# Altium schematic sheet 02-multimodal-pmic.SchDoc
size A4; SheetNumber: 3; SheetTotal: 13
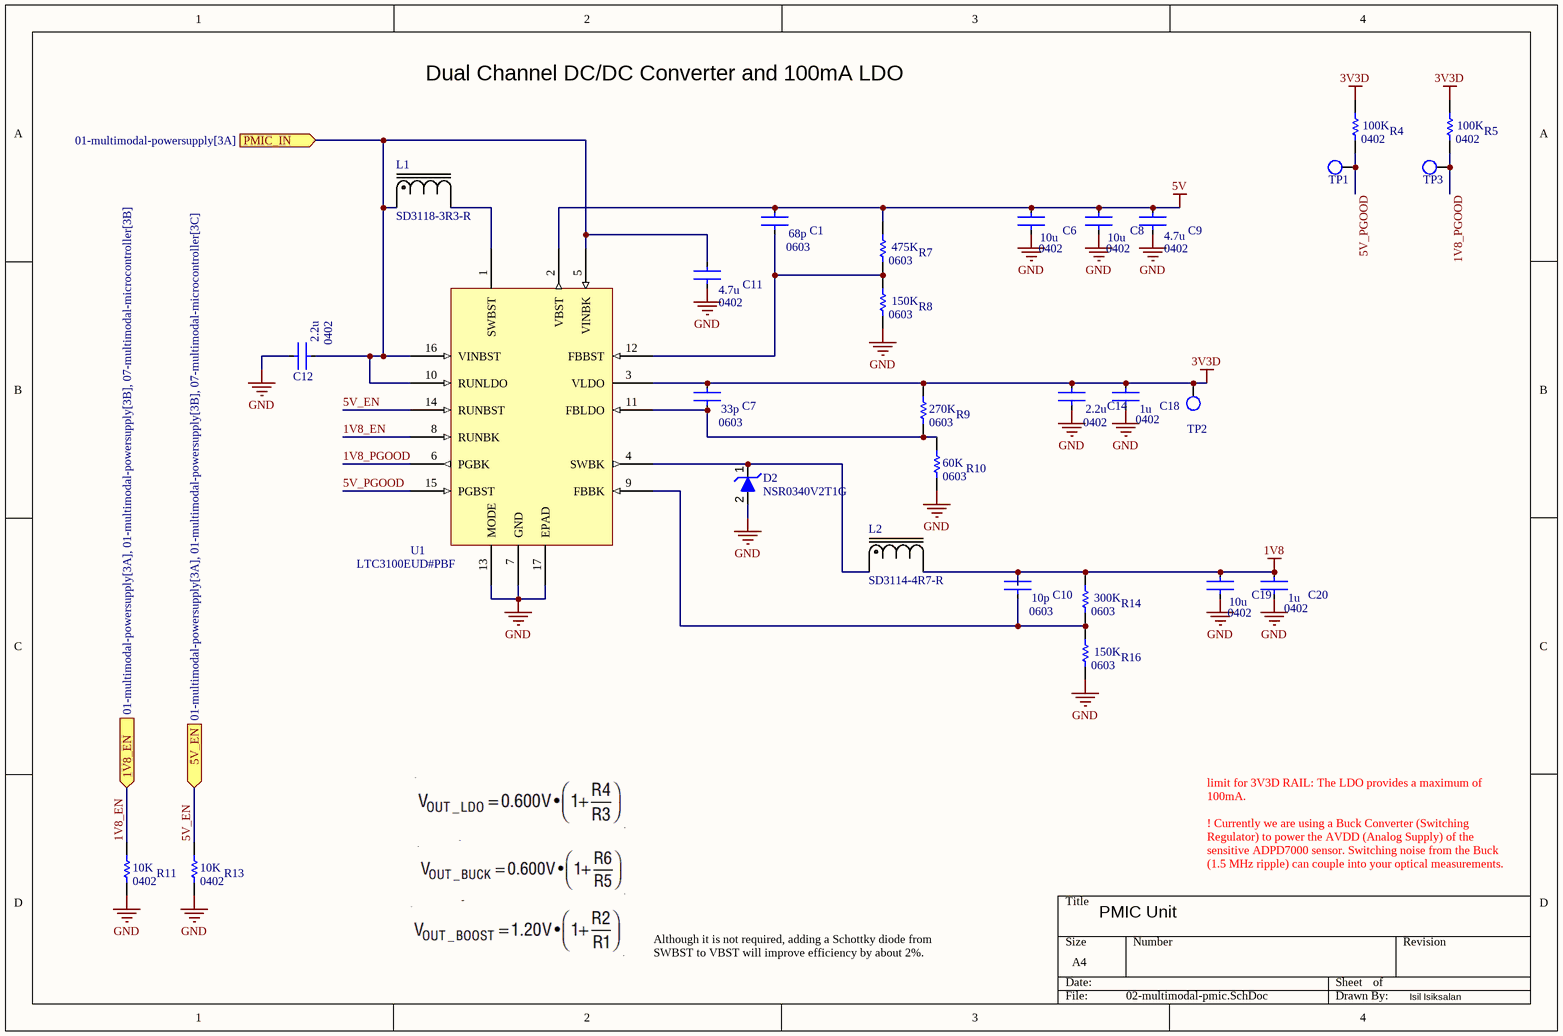
[diagram p0: 02-multimodal-pmic.SchDoc]

## Parts
C1  CGA3E2C0G1H680J080AA  [CAPTDK0603]  (value not drawn)
C6  GRM155R61A106ME11D  [CAPTDK0402]  (value not drawn)
C7  CGA3E2C0G1H330J080AA  [CAPTDK0603]  (value not drawn)
C8  GRM155R61A106ME11D  [CAPTDK0402]  (value not drawn)
C9  C1005X5R1A475K050BC  [CAPTDK0402]  (value not drawn)
C10  CGA3E2C0G1H100D080AA  [CAPTDK0603]  (value not drawn)
C11  C1005X5R1A475K050BC  [CAPTDK0402]  (value not drawn)
C12  CL05A225KO5NQNC  [CAPTDK0402]  (value not drawn)
C14  CL05A225KO5NQNC  [CAPTDK0402]  (value not drawn)
C18  C1005X5R1V105K050BC  [CAPTDK0402]  (value not drawn)
C19  GRM155R61A106ME11D  [CAPTDK0402]  (value not drawn)
C20  C1005X5R1V105K050BC  [CAPTDK0402]  (value not drawn)
D2  NSR0340V2T1G  [SOD-523_STM-L]
L1  SD3118-3R3-R  [SD3118]
L2  SD3114-4R7-R  [SD3114]
R4  RMCF0402FT100K  [RES-STACK-POLE-0402]  (value not drawn)
R5  RMCF0402FT100K  [RES-STACK-POLE-0402]  (value not drawn)
R7  RMCF0603FT475K  [RES-STACK-POLE-0603]  (value not drawn)
R8  RC0603FR-07150KL  [RES-STACK-POLE-0603]  (value not drawn)
R9  RC0603FR-07270KL  [RES-STACK-POLE-0603]  (value not drawn)
R10  RT0603BRD0760KL  [RES-STACK-POLE-0603]  (value not drawn)
R11  RMCF0402FT10K0  [RES-STACK-POLE-0402]  (value not drawn)
R13  RMCF0402FT10K0  [RES-STACK-POLE-0402]  (value not drawn)
R14  RMCF0603FT300K  [RES-STACK-POLE-0603]  (value not drawn)
R16  RC0603FR-07150KL  [RES-STACK-POLE-0603]  (value not drawn)
TP1  TESTPOINT_S  [TESTPOINT_S]  (value not drawn)  (no BOM)
TP2  TESTPOINT_S  [TESTPOINT_S]  (value not drawn)  (no BOM)
TP3  TESTPOINT_S  [TESTPOINT_S]  (value not drawn)  (no BOM)
U1  LTC3100EUD#PBF  [LTC3100EUD#PBF]

## Ports
1V8_EN (in, see 01-multimodal-powersupply[3A], 01-multimodal-powersupply[3B], 07-multimodal-microcontroller[3B]), 5V_EN (in, see 01-multimodal-powersupply[3A], 01-multimodal-powersupply[3B], 07-multimodal-microcontroller[3C]), PMIC_IN (in, see 01-multimodal-powersupply[3A])

## Nets
1V8: C10.1 C19.1 C20.1 L2.2 R14.2
3V3D: C7.1 C14.1 C18.1 R4.2 R5.2 R9.2 TP2.1 U1.3(VLDO)
5V: C1.1 C6.1 C8.1 C9.1 R7.2 U1.2(VBST)
GND: C6.2 C8.2 C9.2 C11.2 C12.1 C14.2 C18.2 C19.2 C20.2 D2.2 R8.1 R10.1 R11.1 R13.1 R16.1 U1.7(GND) U1.13(MODE) U1.17(EPAD)
1V8_EN: R11.2 U1.8(RUNBK) ; port 1V8_EN
1V8_PGOOD: R5.1 TP3.1 U1.6(PGBK)
5V_EN: R13.2 U1.14(RUNBST) ; port 5V_EN
5V_PGOOD: R4.1 TP1.1 U1.15(PGBST)
PMIC_IN: C11.1 C12.2 L1.1 U1.5(VINBK) U1.10(RUNLDO) U1.16(VINBST) ; port PMIC_IN
NetC1_2: C1.2 R7.1 R8.2 U1.12(FBBST)
NetC7_2: C7.2 R9.1 R10.2 U1.11(FBLDO)
NetC10_2: C10.2 R14.1 R16.2 U1.9(FBBK)
NetD2_1: D2.1 L2.1 U1.4(SWBK)
NetL1_2: L1.2 U1.1(SWBST)

## Notes on the sheet
- Dual Channel DC/DC Converter and 100mA LDO
- PMIC Unit
- limit for 3V3D RAIL: The LDO provides a maximum of 100mA.
  ! Currently we are using a Buck Converter (Switching Regulator) to power the AVDD (Analog Supply) of the sensitive ADPD7000 sensor. Switching noise from the Buck (1.5 MHz ripple) can couple into your optical measurements.
- Although it is not required, adding a Schottky diode from
  SWBST to VBST will improve efficiency by about 2%.
- Isil Isiksalan
- (in symbol C1005X5R1A475K050BC) 4.7u; 0402
- (in symbol C1005X5R1V105K050BC) 1u; 0402
- (in symbol CGA3E2C0G1H100D080AA) 10p; 0603
- (in symbol CGA3E2C0G1H330J080AA) 33p; 0603
- (in symbol CGA3E2C0G1H680J080AA) 68p; 0603
- (in symbol CL05A225KO5NQNC) 2.2u; 0402
- (in symbol GRM155R61A106ME11D) 10u; 0402
- (in symbol RC0603FR-07150KL) 150K; 0603
- (in symbol RC0603FR-07270KL) 270K; 0603
- (in symbol RMCF0402FT10K0) 10K; 0402
- (in symbol RMCF0402FT100K) 100K; 0402
- (in symbol RMCF0603FT300K) 300K; 0603
- (in symbol RMCF0603FT475K) 475K; 0603
- (in symbol RT0603BRD0760KL) 60K; 0603

## Library data of the parts
C1 = CGA3E2C0G1H680J080AA: CAP CER 68PF 50V C0G 0603; Supplier 1: Avnet; Supplier Part Number 1: 80X3175
C6 C8 C19 = GRM155R61A106ME11D: CAP CER 10UF 10V X5R 0402; Supplier 1: Digi-Key; Supplier Part Number 1: 490-GRM155R61A106ME11DCT-ND
C7 = CGA3E2C0G1H330J080AA: CAP CER 33PF 50V C0G 0603; Supplier 1: Newark; Supplier Part Number 1: CGA3E2C0G1H330J080AA
C9 C11 = C1005X5R1A475K050BC: CAP CER 4.7UF 10V X5R 0402; Supplier 1: Digi-Key; Supplier Part Number 1: 445-13820-1-ND
C10 = CGA3E2C0G1H100D080AA: CAP CER 10PF 50V C0G 0603; Supplier 1: Avnet; Supplier Part Number 1: 80X3161
C12 C14 = CL05A225KO5NQNC: CAP CER 2.2UF 16V X5R 0402; Supplier 1: Avnet; Supplier Part Number 1: CL05A225KO5NQNC
C18 C20 = C1005X5R1V105K050BC: CAP CER 1UF 35V X5R 0402; Supplier 1: Digi-Key; Supplier Part Number 1: 445-9073-1-ND
D2 = NSR0340V2T1G: DIODE SCHOTTKY 40V 250MA SOD523; Manufacturer: Diodes; Manufacturer Part Number: DESD3V3S1BL-7B; Direction: Bidirectional; Number of Bidirectional Channels: 1; Reverse Standoff Voltage: 3.3V; Min Breakdown Voltage: 3.8V; Clamping Voltage: 7V; Peak Pulse Power: 35W; Power Line Protection: No; Max Reverse Leakage Current: 100nA; Element Configuration: Single; Breakdown Voltage: 6.5V; Peak Pulse Current: 5A; RoHS: Yes; Category: TVS Diodes; Stock 1: 514017; Pricing 1: 1=0.32000, 10=0.26000, 100=0.13790, 500=0.09076, 1000=0.06171, 2000=0.05566, 5000=0.04840 (USD); Mount: Surface Mount; Number of Pins: 2; Min Operating Temperature: -65°C; Max Operating Temperature: 150°C; Packaging: Tape and Reel; Package Quantity: 10000; Polarity: Bidirectional; Termination: SMD/SMT; Working Voltage: 3.3V; Max Power Dissipation: 35W; Resistor Type: Zener; Radiation Hardening: No; RoHS Compliant: Yes; ComponentLink1URL: https://www.diodes.com/assets/Datasheets/DESD3V3S1BL.pdf; ComponentLink1Description: Datasheet; ComponentLink2Description: New link; ComponentLink2URL: *; Supplier 1: Avnet; Supplier Part Number 1: NSR0340V2T1G
L1 = SD3118-3R3-R: FIXED IND 3.3UH 1.22A 113 MOHM; Manufacturer_Name: Eaton; Manufacturer_Part_Number: SD3114-4R7-R; Copyright: Copyright (C) 2026 Ultra Librarian. All rights reserved.
L2 = SD3114-4R7-R: No Description Available; Manufacturer_Name: Eaton; Copyright: Copyright (C) 2026 Ultra Librarian. All rights reserved.; Manufacturer_Part_Number: SD3114-4R7-R
R4 R5 = RMCF0402FT100K: RES 100K OHM 1% 1/16W 0402; Supplier 1: Digi-Key; Supplier Part Number 1: RMCF0402FT100KCT-ND
R7 = RMCF0603FT475K: RES 475K OHM 1% 1/10W 0603; Supplier 1: DigiKey; Supplier Part Number 1: RMCF0603FT475KCT-ND
R8 R16 = RC0603FR-07150KL: RES 150K OHM 1% 1/10W 0603; Supplier 1: Avnet; Supplier Part Number 1: RC0603FR-07150KL
R9 = RC0603FR-07270KL: RES 270K OHM 1% 1/10W 0603; Supplier 1: Avnet; Supplier Part Number 1: RC0603FR-07270KL
R10 = RT0603BRD0760KL: RES 60K OHM 0.1% 1/10W 0603; Supplier 1: DigiKey; Supplier Part Number 1: 13-RT0603BRD0760KLCT-ND
R11 R13 = RMCF0402FT10K0: RES 10K OHM 1% 1/16W 0402; Supplier 1: Digi-Key; Supplier Part Number 1: RMCF0402FT10K0CT-ND
R14 = RMCF0603FT300K: RES 300K OHM 1% 1/10W 0603; Supplier 1: DigiKey; Supplier Part Number 1: RMCF0603FT300KCT-ND
TP1-TP3 = TESTPOINT_S: Testpoint Surface Pad
U1 = LTC3100EUDPBF: PMIC - Voltage Regulators - Linear Switching 3 Output Step-Down (Buck) (1), Step-Up (Boost) (1), Linear (LDO) (1) 1.5MHz 16-QFN (3x3); Manufacturer_Name: Analog Devices Inc; Copyright: Copyright (C) 2025 Ultra Librarian. All rights reserved.; Manufacturer_Part_Number: LTC3100EUD#PBF; Datasheet: https://www.analog.com/media/en/technical-documentation/data-sheets/3100fb.pdf; RefDes: RefDes; Type: Type; Supplier 1: DigiKey; Supplier Part Number 1: LTC3100EUD#PBF-ND